# Altium schematic sheet 3_UART_RS232_Conversion.SchDoc
size A4
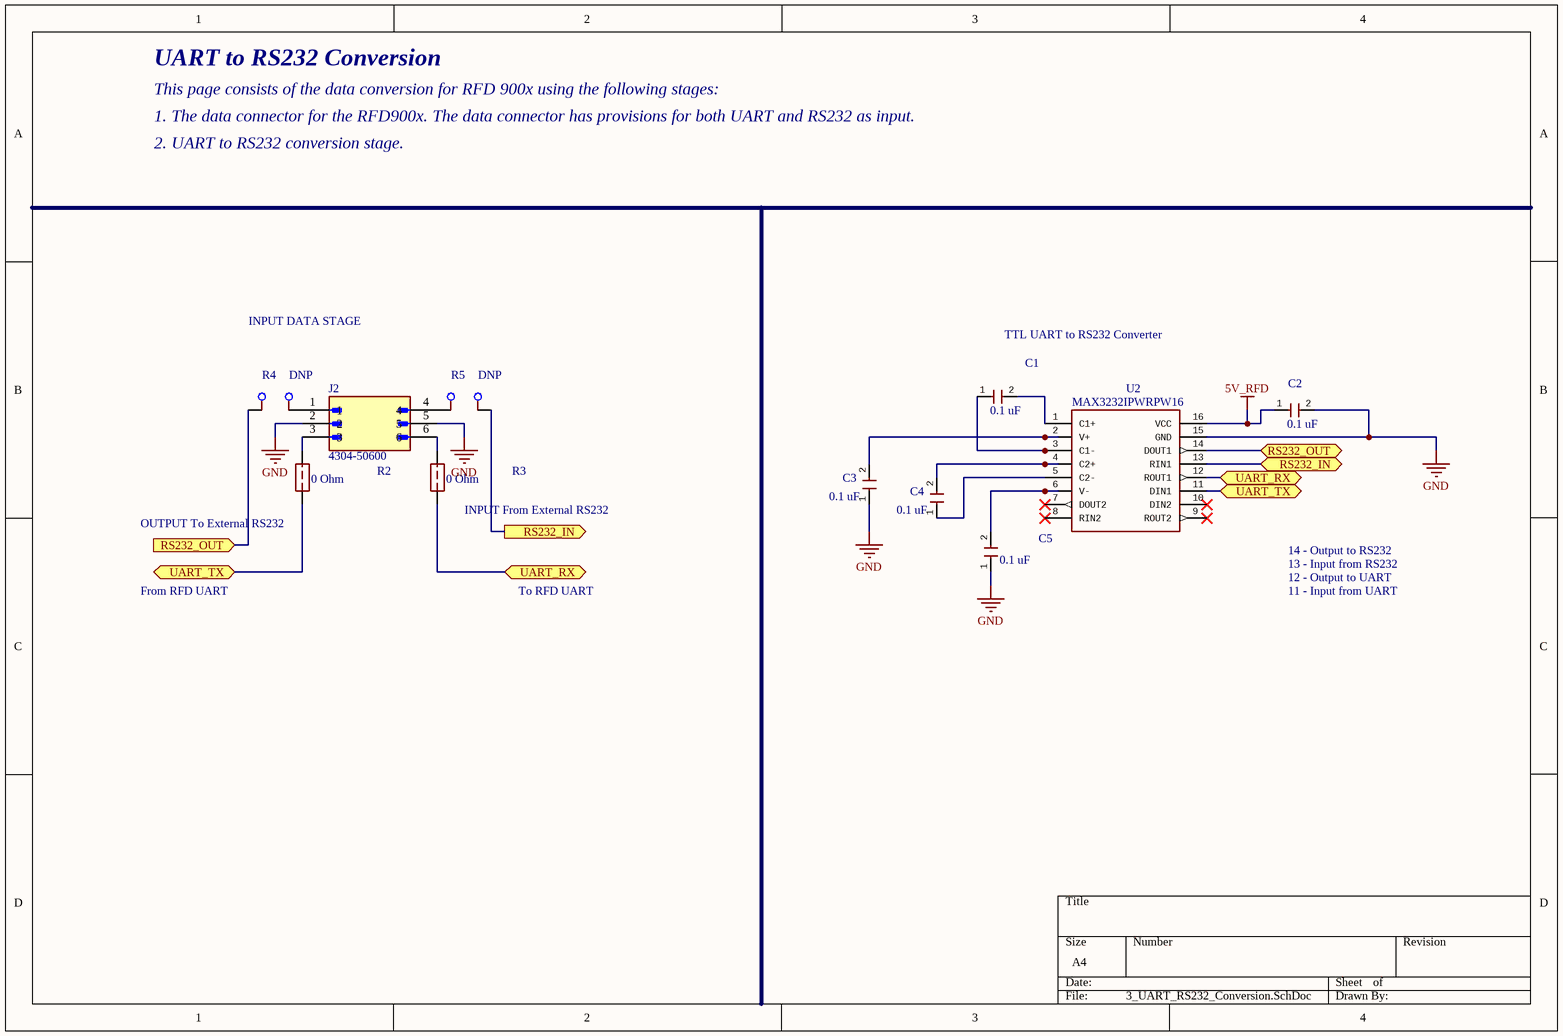
[diagram p0: 3_UART_RS232_Conversion.SchDoc]

## Parts
C1  value 0.1 uF  [CAP_0603]  (hidden comment: CL10B104KB8NNNC)
C2  value 0.1 uF  [CAP_0603]  (hidden comment: CL10B104KB8NNNC)
C3  value 0.1 uF  [CAP_0603]  (hidden comment: CL10B104KB8NNNC)
C4  value 0.1 uF  [CAP_0603]  (hidden comment: CL10B104KB8NNNC)
C5  value 0.1 uF  [CAP_0603]  (hidden comment: CL10B104KB8NNNC)
J2  4304-50600  [MOLEX_MICRO-6POS]
R2  value 0 Ohm  [RES_0603]  (hidden comment: ERJ3GEY0R00V)
R3  value 0 Ohm  [RES_0603]  (hidden comment: ERJ3GEY0R00V)
R4  value DNP  [RES_0603_DNP]  (hidden comment: 0603 Resistor DNP)
R5  value DNP  [RES_0603_DNP]  (hidden comment: 0603 Resistor DNP)
U2  MAX3232IPWRPW16  [INTERFACE_TSSOP-16]

## Ports
RS232_IN, RS232_IN (out), RS232_OUT, RS232_OUT (in), UART_RX, UART_TX

## Nets
5V_RFD: C2.1 U2.16(VCC)
GND: C2.2 C3.1 C5.1 J2.2 J2.5 U2.15(GND)
RS232_IN: R5.2 U2.13(RIN1) ; port RS232_IN
RS232_OUT: R4.1 U2.14(DOUT1) ; port RS232_OUT
UART_RX: R3.1 U2.12(ROUT1) ; port UART_RX
UART_TX: R2.1 U2.11(DIN1) ; port UART_TX
NetC1_1: C1.1 U2.3(C1-)
NetC1_2: C1.2 U2.1(C1+)
NetC3_2: C3.2 U2.2(V+)
NetC4_1: C4.1 U2.5(C2-)
NetC4_2: C4.2 U2.4(C2+)
NetC5_2: C5.2 U2.6(V-)
NetJ2_1: J2.1 R4.2
NetJ2_3: J2.3 R2.2
NetJ2_4: J2.4 R5.1
NetJ2_6: J2.6 R3.2

Not connected (* = marked no-connect by the designer): U2 7(DOUT2)* 8(RIN2)* 9(ROUT2)* 10(DIN2)*

## Notes on the sheet
- UART to RS232 Conversion
- This page consists of the data conversion for RFD 900x using the following stages:
- 1. The data connector for the RFD900x. The data connector has provisions for both UART and RS232 as input.
- 2. UART to RS232 conversion stage.
- INPUT DATA STAGE
- TTL UART to RS232 Converter
- (near R3) INPUT From External RS232
- (near R2) OUTPUT To External RS232
- 13 - Input from RS232
- 14 - Output to RS232
- 12 - Output to UART
- From RFD UART
- To RFD UART
- 11 - Input from UART

## Library data of the parts
C1-C5 = CL10B104KB8NNNC: Cap Ceramic 0.1uF 50V 0603; Manufacturer_Name: Samsung; Link: https://www.digikey.ca/en/products/detail/samsung-electro-mechanics/CL10B104KB8NNNC/3886658?s=N4IgTCBcDaIMIBkCMAGAQqgLAaTQDgDki4QBdAXyA; Package: 0603; PartNumber: CL10B104KB8NNNC; SupplierPartNumber: 1276-1000-2-ND; SuppliersPartNumber: C1591
J2 = 43045-0600: Molex Microfit 6POS; PartNumber: 430450600; SupplerNumber: WM1815-ND; Package: None; Manufacturer: Molex; Value: *; Link: https://www.digikey.ca/en/products/detail/molex/0430450600/252528; SuppliersPartNumber: *
R2 R3 = ERJ3GEY0R00V: Res 0Ohm 1/10W 0603; Link: https://www.digikey.ca/en/products/detail/panasonic-electronic-components/ERJ-3GEY0R00V/135656?s=N4IgTCBcDaIKICUBSBmA4nAmgBgd7AaiALoC%2BQA; Package: 0603; SupplierPartNumber: P0.0GTR-ND; SuppliersPartNumber: C122704; PartNumber: ERJ3GEY0R00V
R4 R5 = RES_0603: 0603 RES Footprint; SuppliersPartNumber: *
U2 = MAX3232IPWRPW16: Transceiver 3.3~5V 250Kbps; Manufacturer: Texas Instruments; Value: 3V~5.5V transceiver; SupplierNumber: 296-13100-2-ND; PartNumber: MAX3232IPWR; SuppliersPartNumber: C113205; Link: https://jlcpcb.com/partdetail/TexasInstruments-MAX3232IPWR/C113205; Package: TSSOP-16